# Altium project HYDRA_V3_RECOVERY.PrjPcb (part 2 of 2)

## Sheet SENSOR_BANK.SchDoc
size A4; SheetNumber: 4; SheetTotal: 6
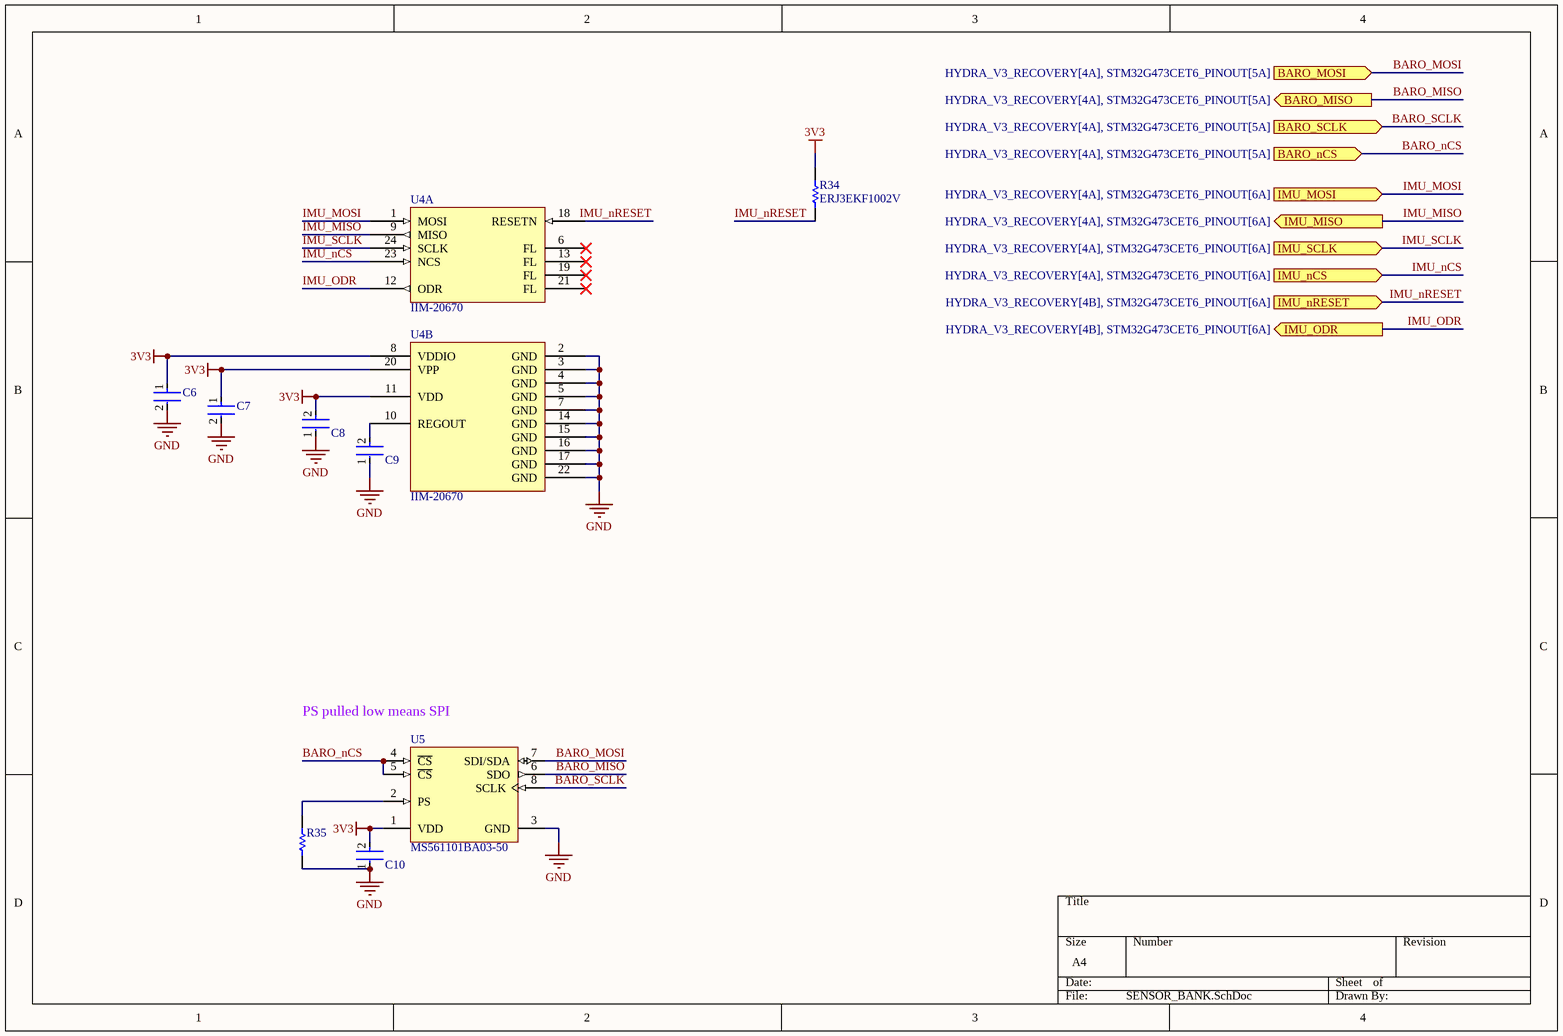
[diagram p6: SENSOR_BANK.SchDoc]

### Parts
C6  CC0402KPX7R7BB103  [FP-CC0402-MFG]  (value not drawn)
C7  CC0402KPX7R7BB103  [FP-CC0402-MFG]  (value not drawn)
C8  GRM155R71C104KA88D  [FP-GRM15-MFG]  (value not drawn)
C9  GRM155R71C104KA88D  [FP-GRM15-MFG]  (value not drawn)
C10  GRM155R71C104KA88D  [FP-GRM15-MFG]  (value not drawn)
R34  ERJ3EKF1002V  [RESC1609X55X30LL15T15]
R35  0402 JUMPER  [RESC1005X40X25ML05T05]  (value not drawn)
U4  IIM-20670  [PQFN50P450X450X115_HS-25N]  (parts A,B of 2)
U5  MS561101BA03-50  [MSI-MS561101BA03-50-8_V]

### Ports
BARO_MISO (out, see HYDRA_V3_RECOVERY[4A], STM32G473CET6_PINOUT[5A]), BARO_MOSI (in, see HYDRA_V3_RECOVERY[4A], STM32G473CET6_PINOUT[5A]), BARO_nCS (in, see HYDRA_V3_RECOVERY[4A], STM32G473CET6_PINOUT[5A]), BARO_SCLK (in, see HYDRA_V3_RECOVERY[4A], STM32G473CET6_PINOUT[5A]), IMU_MISO (out, see HYDRA_V3_RECOVERY[4A], STM32G473CET6_PINOUT[6A]), IMU_MOSI (in, see HYDRA_V3_RECOVERY[4A], STM32G473CET6_PINOUT[6A]), IMU_nCS (in, see HYDRA_V3_RECOVERY[4A], STM32G473CET6_PINOUT[6A]), IMU_nRESET (in, see HYDRA_V3_RECOVERY[4B], STM32G473CET6_PINOUT[6A]), IMU_ODR (out, see HYDRA_V3_RECOVERY[4B], STM32G473CET6_PINOUT[6A]), IMU_SCLK (in, see HYDRA_V3_RECOVERY[4A], STM32G473CET6_PINOUT[6A])

### Nets
3V3: C6.1 C7.1 C8.2 C10.2 R34.2 U4.8(VDDIO) U4.11(VDD) U4.20(VPP) U5.1(VDD)
GND: C6.2 C7.2 C8.1 C9.1 C10.1 R35.1 U4.2(GND) U4.3(GND) U4.4(GND) U4.5(GND) U4.7(GND) U4.14(GND) U4.15(GND) U4.16(GND) U4.17(GND) U4.22(GND) U5.3(GND)
BARO_MISO: U4.9(MISO) U5.6(SDO) ; port IMU_MISO, port BARO_MISO  [also labelled IMU_MISO]
BARO_MOSI: U4.1(MOSI) U5.7(SDI/SDA) ; port IMU_MOSI, port BARO_MOSI  [also labelled IMU_MOSI]
BARO_nCS: U5.4(~{CS}) U5.5(~{CS}) ; port BARO_nCS
BARO_SCLK: U4.24(SCLK) U5.8(SCLK) ; port BARO_SCLK, port IMU_SCLK  [also labelled IMU_SCLK]
IMU_nCS: U4.23(NCS) ; port IMU_nCS
IMU_nRESET: R34.1 U4.18(RESETN) ; port IMU_nRESET
IMU_ODR: U4.12(ODR) ; port IMU_ODR
NetC9_2: C9.2 U4.10(REGOUT)
NetR35_2: R35.2 U5.2(PS)

Not connected (* = marked no-connect by the designer): U4 6(FL)* 13(FL)* 19(FL)* 21(FL)*

### Notes on the sheet
- (near U5) PS pulled low means SPI

### Library data of the parts
C6 C7 = CMP-03422-000420-1: CC0402 10 nF X7R 10.00% 16 V; Manufacturer: YAGEO; Capacitance: 10 nF; Value: 10 nF; Tolerance: 0.1; Voltage Rating: 16 V; Automotive Grade: NA; Temperature Coefficient: 30ppm/°C; Material: Ceramic; Automotive: No; Device Class L1: Passive Components; Temperature Range Low: -55°C; Ipc Land Pattern Name: CAPC10050X50; Temperature Characteristic: X7R; Lead Free: Yes; Footprint Url: http://www.yageo.com/exep/pages/download/literatures/UPY-C_GEN_24.pdf; Octopart: https://octopart.com/cc0402kpx7r7bb103-yageo-12885102; RoHS: TRUE; Height: 0.55mm; Device Class L3: Ceramic Capacitors; Mouser Description: Multilayer Ceramic Capacitors MLCC - SMD/SMT 10nF 16V X7R 10%; Package: CC0402; ComponentLink2Description: Datasheet; Category: Cap; ComponentLink2URL: http://www.yageo.com/documents/recent/UPY-GP_NP0_16V-to-50V_16.pdf; Temperature: -55°C to +125°C; Manufacturer Part Number: CC0402KPX7R7BB103; Temperature Range High: +125°C; Device Class L2: Capacitors
C8-C10 = CMP-2100-03641-2: CAP CER 0.1UF 16V X7R 0402; Manufacturer: Murata; Standoff Height: 0mm; Tolerance: 10%; Voltage Rating: 16Vdc; Material: Ceramic; Capacitance: 0.10μF; Value: 0.10μF; RoHS: TRUE; Manufacturer Part Number: GRM155R71C104KA88D; Temperature Characteristic: X7R; Octopart: https://octopart.com/grm155r71c104ka88d-murata-196880; Digikey Description: CAP CER 0.1UF 16V X7R 0402; Device Class L3: Ceramic Capacitors; Height: 0.55mm; ComponentLink2Description: Datasheet; Temperature Range Low: -55°C; Ipc Land Pattern Name: CAPC10050X219; ComponentLink2URL: https://search.murata.co.jp/Ceramy/image/img/A01X/G101/ENG/GRM155R71H471KA01-01A.pdf; Device Class L1: Passive Components; Lead Free: yes; Category: Cap; Package: GRM15; Temperature: -55°C to +125°C; Device Class L2: Capacitors; Temperature Range High: +125°C; Mouser Description: 0402 0.1 uF 16V ±10 % Tolerance X7R SMT Multilayer Ceramic Capacitor
R34 = CMP-1012-00623-3: Chip Resistor, 10 KOhm, +/- 1%, 0.1 W, -55 to 155 degC, 0603 (1608 Metric), RoHS, Tape and Reel; Manufacturer: Panasonic; Voltage Rating: 75V; Case\/Package: 0603; Power Rating: 100mW; Resistance: 10KOhm; Temperature Coefficient: 100ppm\/degreesC; Number of Pins: 2; Package Reference: 603; Depth: 0.8mm; Mount: SurfaceMount; Package Description: 2-Pin Surface Mount Device, Body 1.6 x 0.85 mm; Datasheet Version: 02/2017; Length: 1.6mm; Lead Free: LeadFree; Height: 0.45mm; Number of Terminations: 2; Max Power Dissipation: 100mW; Min Operating Temperature: -55degC; Datasheet URL: https://industrial.panasonic.com/cdbs/www-data/pdf/RDA0000/AOA0000C304.pdf; Termination: SMD/SMT; Case Code (Metric): 1608; Case Code (Imperial): 0603; Tolerance: 1%; Max Operating Temperature: 155degC; RoHSCompliant: true; Voltage Rating (DC): 75V; Radiation Hardening: No; Packaging: TapeandReel; Composition: ThickFilm; Mounting Technology: SurfaceMount; Manufacturer URL: http://www.panasonic.com/; Width: 0.031inch; REACH SVHC: NoSVHC; Contact Plating: Tin; Military Standard: Not; Package Quantity: 1
R35 = CMP-009-00118-2: READ THE NAME; Pins: 2; Component Type: Standard; Design Item ID: CMP-009-00206-2; Source: 0402jump.SchLib
U4 = CMP-010-00029-2: 6-axis IMU with extended temperature range and high VRE performance
U5 = CMP-2000-05251-1: Barometric Pressure Sensor, with Stainless Steel Cap, 1.8 to 3.6 V, -45 to 85 degC, 8-Pin QFN, RoHS, Tape and Reel; Manufacturer: Measurement Specialties; Operating Pressure Max: 1200mbar; Supply Current: 12.5µA; Supply Voltage Max: 3.6V; Supply Voltage Min: 1.8V; No. of Pins: 8; Connection Size: 0.5mm; SVHC: NoSVHC(20-Jun-2013); Operating Pressure Min: 10mbar; Manufacturer URL: http://www.meas-spec.com/; Operating Temperature Min: -40degC; Pressure Type: Barometric; Package Reference: MS561101BA03-50-8; Datasheet URL: http://www.te.com/commerce/DocumentDelivery/DDEController?Action=srchrtrv&DocNm=MS5611-01BA03&DocType=Data+Sheet&DocLang=English&DocFormat=pdf&PartCntxt=CAT-BLPS0036; Package Description: 8-Pin Surface Mount Device, Body 5 x 3 mm, Pitch 1.25 mm; Sensor Case Style: QFN; Datasheet Version: Sep-15; Operating Temperature Max: 85degC

## Sheet SAFETY_SWITCH.SchDoc
size B; SheetNumber: 5; SheetTotal: 7
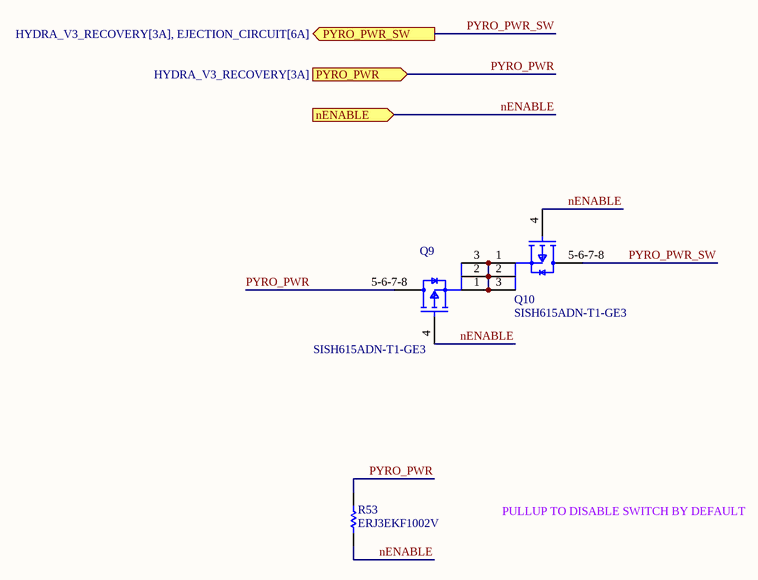
[diagram p7: SAFETY_SWITCH.SchDoc]

### Parts
Q9  SISH615ADN-T1-GE3  [SISH615ADN-T1-GE3-Footprint-1]
Q10  SISH615ADN-T1-GE3  [SISH615ADN-T1-GE3-Footprint-1]
R53  ERJ3EKF1002V  [RESC1609X55X30LL15T15]

### Ports
nENABLE (in), PYRO_PWR (in, see HYDRA_V3_RECOVERY[3A]), PYRO_PWR_SW (out, see HYDRA_V3_RECOVERY[3A], EJECTION_CIRCUIT[6A])

### Nets
nENABLE: Q9.4(G) Q10.4(G) R53.2 ; port nENABLE  [project net nARM_PYRO]
PYRO_PWR: Q9.5-6-7-8(D) R53.1 ; port PYRO_PWR
PYRO_PWR_SW: Q10.5-6-7-8(D) ; port PYRO_PWR_SW
NetQ9_1: Q9.1(S) Q9.2(S) Q9.3(S) Q10.1(S) Q10.2(S) Q10.3(S)

### Notes on the sheet
- PULLUP TO DISABLE SWITCH BY DEFAULT

### Library data of the parts
Q9 Q10 = CMP-013-00036-1: Trans MOSFET P-CH 20V 22.1A 8-Pin PowerPAK 1212 EP T/R
R53 = CMP-1012-00623-3: as R34 on sheet SENSOR_BANK; Number of Pins: 2; Package Reference: 603; Depth: 0.8mm; Mount: SurfaceMount; Package Description: 2-Pin Surface Mount Device, Body 1.6 x 0.85 mm; Datasheet Version: 02/2017; Length: 1.6mm; Lead Free: LeadFree; Height: 0.45mm; Number of Terminations: 2; Max Power Dissipation: 100mW; Min Operating Temperature: -55degC; Datasheet URL: https://industrial.panasonic.com/cdbs/www-data/pdf/RDA0000/AOA0000C304.pdf; Termination: SMD/SMT; Case Code (Metric): 1608; Case Code (Imperial): 0603; Tolerance: 1%; Max Operating Temperature: 155degC; RoHSCompliant: true; Voltage Rating (DC): 75V; Radiation Hardening: No; Packaging: TapeandReel; Composition: ThickFilm; Mounting Technology: SurfaceMount; Manufacturer URL: http://www.panasonic.com/; Width: 0.031inch; REACH SVHC: NoSVHC; Contact Plating: Tin; Military Standard: Not; Package Quantity: 1

## Nets that join several sheets
3V3: OC_PROT (7 pins), STM32G473CET6_PINOUT (22 pins), EJECTION_CIRCUIT (8 pins), SENSOR_BANK (9 pins)
GND: HYDRA_V3_RECOVERY (48 pins), OC_PROT (16 pins), STM32G473CET6_PINOUT (37 pins), EJECTION_CIRCUIT (22 pins), SENSOR_BANK (17 pins)
VCC: HYDRA_V3_RECOVERY (J1.01 J1.02 J3.01 J3.02), OC_PROT (D1.3 R2.2 R13.1 U1.6), STM32G473CET6_PINOUT (5 pins)
3V3_PRE_SHUNT: HYDRA_V3_RECOVERY (8 pins), OC_PROT (R10.1 R11.2)
BARO_MISO: STM32G473CET6_PINOUT (U6.28), SENSOR_BANK (U4.9 U5.6)
BARO_MOSI: STM32G473CET6_PINOUT (U6.29), SENSOR_BANK (U4.1 U5.7)
BARO_SCLK: STM32G473CET6_PINOUT (U6.27), SENSOR_BANK (U4.24 U5.8)
CAN0_N: HYDRA_V3_RECOVERY (J1.16 J3.16), STM32G473CET6_PINOUT (R40.2 U8.12)
CAN0_P: HYDRA_V3_RECOVERY (J1.15 J3.15), STM32G473CET6_PINOUT (R40.1 U8.13)
CAN1_N: HYDRA_V3_RECOVERY (J1.20 J3.20), STM32G473CET6_PINOUT (R38.1 U7.6)
CAN1_P: HYDRA_V3_RECOVERY (J1.19 J3.19), STM32G473CET6_PINOUT (R38.2 U7.7)
CAN_INH: OC_PROT (R5.2), STM32G473CET6_PINOUT (U8.7)
DROGUE_MATCH: HYDRA_V3_RECOVERY (P3.1 P3.2), EJECTION_CIRCUIT (R22.2 U3.3 U3.4)
IMU_nCS: STM32G473CET6_PINOUT (U6.26), SENSOR_BANK (U4.23)
MAIN_MATCH: HYDRA_V3_RECOVERY (P2.2 P2.3), EJECTION_CIRCUIT (R14.2 U2.3 U2.4)
nARM_PYRO: HYDRA_V3_RECOVERY (P1.1), SAFETY_SWITCH (Q9.4 Q10.4 R53.2)
PYRO_PWR: HYDRA_V3_RECOVERY (F1.2), SAFETY_SWITCH (Q9.5-6-7-8 R53.1)
PYRO_PWR_SW: EJECTION_CIRCUIT (10 pins), SAFETY_SWITCH (Q10.5-6-7-8)